# Altium project sx1278.PrjPcb
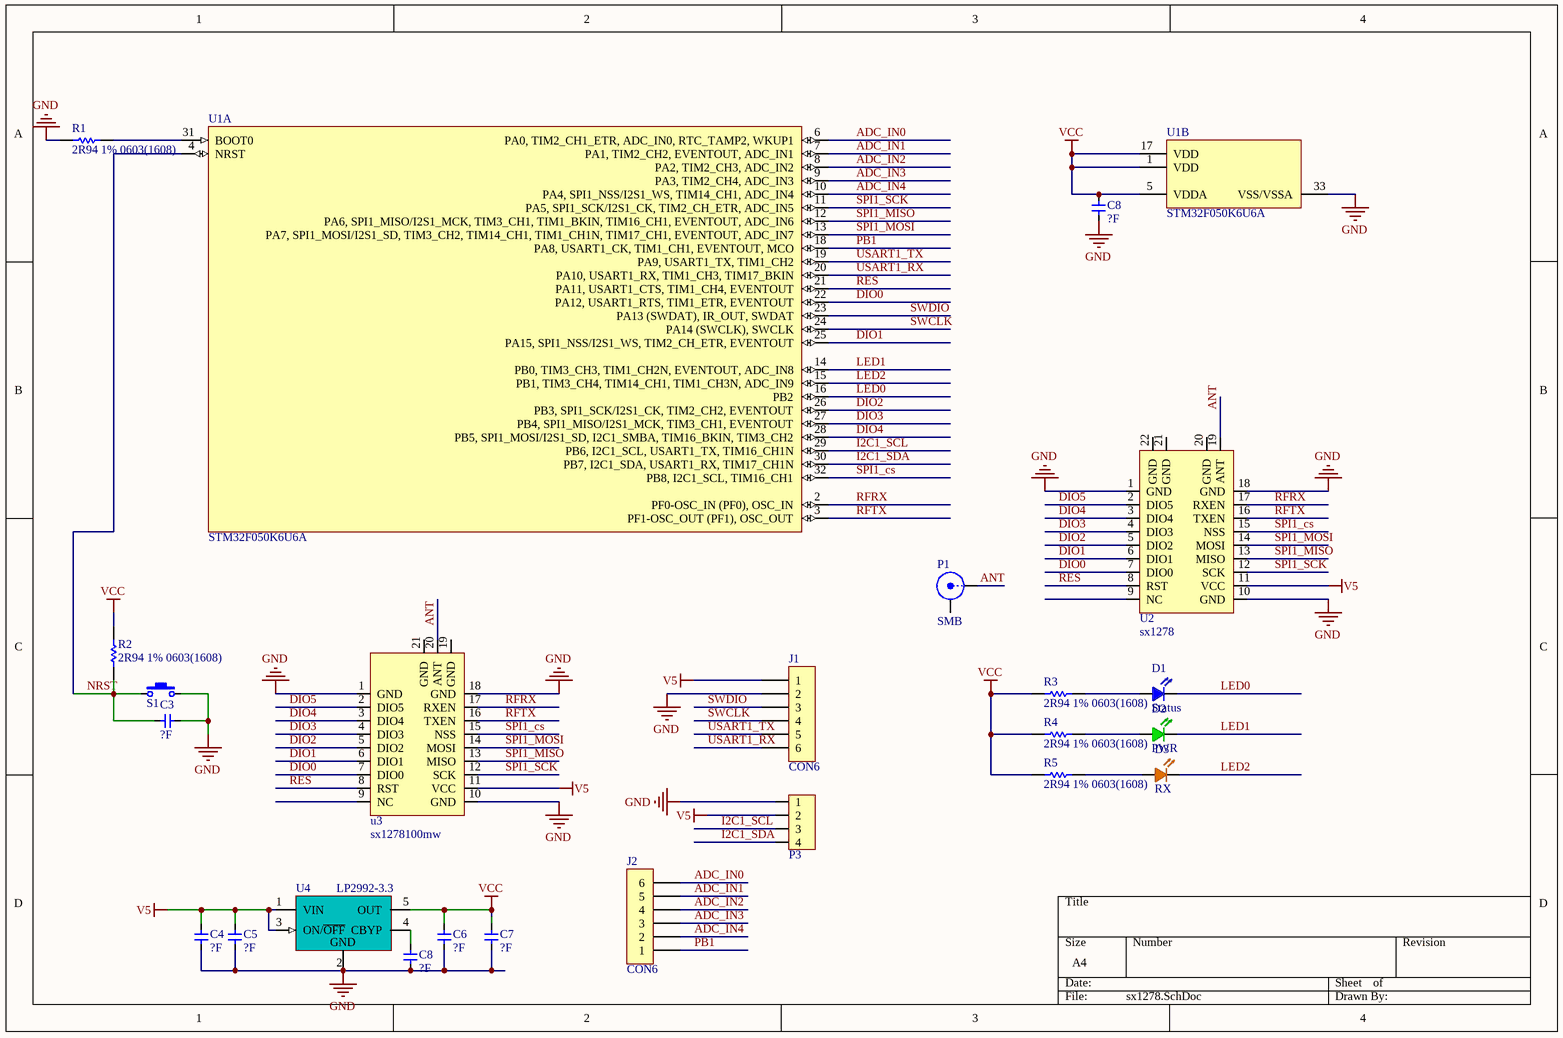
[diagram p0: sx1278.SchDoc]
1 sheet, 24 parts. Net scope: global (net labels, ports and power ports of the same name join across sheets).
Board file: sx1278.PcbDoc

## Sheet sx1278.SchDoc
size A4

### Parts
(Parts that share a designator on the sheet are numbered #1, #2 ... from top to bottom, then left to right.)
C3  value ?F  [0603AC]  (hidden comment: Cap_0603)
C4  value ?F  [C1206]  (hidden comment: Cap_0603)
C5  value ?F  [0603AC]  (hidden comment: Cap_0603)
C6  value ?F  [C1206]  (hidden comment: Cap_0603)
C7  value ?F  [0603AC]  (hidden comment: Cap_0603)
C8#1  value ?F  [0603AC]  (hidden comment: Cap_0603)
C8#2  value ?F  [0603AC]  (hidden comment: Cap_0603)
D1  Status  [LED_0603_BLUE]
D2  PWR  [LED_0603_GREEN]
D3  RX  [LED_0603_YELLOW]
J1  CON6  [DF13C-6P-1.25V]
J2  CON6  [HDR1X6]
P1  SMB  [SMB_V-RJ45]
P3  HDR1x4_1.27  [HDR1X4]  (value not drawn)
R1  2R94 1% 0603(1608)  [RESC0603(1608)_L]
R2  2R94 1% 0603(1608)  [RESC0603(1608)_L]
R3  2R94 1% 0603(1608)  [RESC0603(1608)_L]
R4  2R94 1% 0603(1608)  [RESC0603(1608)_L]
R5  2R94 1% 0603(1608)  [RESC0603(1608)_L]
S1  ButtonTACT_3x6x2.5_180  [按键-贴片]  (value not drawn)
U1  STM32F050K6U6A  [UFQFPN32_M]  (parts A,B of 2)
U2  sx1278  [SPI-E19-433MS1W]
u3  sx1278100mw  [PCBComponent_1 - duplicate]
U4  LP2992-3.3  [SOT23-5L]

### Nets
GND: C3.2 C4.1 C5.1 C6.1 C7.1 C8#1.1 C8#2.1 J1.2 P3.1 R1.1 S1.2 U1.33(VSS/VSSA) U2.1(GND) U2.10(GND) U2.18(GND) u3.1(GND) u3.10(GND) u3.18(GND) U4.2(GND)
V5: C4.2 C5.2 J1.1 P3.2 U2.11(VCC) u3.11(VCC) U4.1(VIN) U4.3(ON/~{OFF})
VCC: C6.2 C7.2 C8#1.2 R2.2 R3.1 R4.1 R5.1 U1.1(VDD) U1.5(VDDA) U1.17(VDD) U4.5(OUT)
ADC_IN0: J2.6 U1.6(PA0,_TIM2_CH1_ETR,_ADC_IN0,_RTC_TAMP2,_WKUP1)
ADC_IN1: J2.5 U1.7(PA1,_TIM2_CH2,_EVENTOUT,_ADC_IN1)
ADC_IN2: J2.4 U1.8(PA2,_TIM2_CH3,_ADC_IN2)
ADC_IN3: J2.3 U1.9(PA3,_TIM2_CH4,_ADC_IN3)
ADC_IN4: J2.2 U1.10(PA4,_SPI1_NSS/I2S1_WS,_TIM14_CH1,_ADC_IN4)
ANT: P1.1(X) U2.19(ANT) u3.20(ANT)
DIO0: U1.22(PA12,_USART1_RTS,_TIM1_ETR,_EVENTOUT) U2.7(DIO0) u3.7(DIO0)
DIO1: U1.25(PA15,_SPI1_NSS/I2S1_WS,_TIM2_CH_ETR,_EVENTOUT) U2.6(DIO1) u3.6(DIO1)
DIO2: U1.26(PB3,_SPI1_SCK/I2S1_CK,_TIM2_CH2,_EVENTOUT) U2.5(DIO2) u3.5(DIO2)
DIO3: U1.27(PB4,_SPI1_MISO/I2S1_MCK,_TIM3_CH1,_EVENTOUT) U2.4(DIO3) u3.4(DIO3)
DIO4: U1.28(PB5,_SPI1_MOSI/I2S1_SD,_I2C1_SMBA,_TIM16_BKIN,_TIM3_CH2) U2.3(DIO4) u3.3(DIO4)
DIO5: U2.2(DIO5) u3.2(DIO5)
I2C1_SCL: P3.3 U1.29(PB6,_I2C1_SCL,_USART1_TX,_TIM16_CH1N)
I2C1_SDA: P3.4 U1.30(PB7,_I2C1_SDA,_USART1_RX,_TIM17_CH1N)
LED0: D1.1(K) U1.16(PB2)
LED1: D2.1(K) U1.14(PB0,_TIM3_CH3,_TIM1_CH2N,_EVENTOUT,_ADC_IN8)
LED2: D3.1(K) U1.15(PB1,_TIM3_CH4,_TIM14_CH1,_TIM1_CH3N,_ADC_IN9)
NRST: C3.1 R2.1 S1.1 U1.4(NRST)
PB1: J2.1 U1.18(PA8,_USART1_CK,_TIM1_CH1,_EVENTOUT,_MCO)
RES: U1.21(PA11,_USART1_CTS,_TIM1_CH4,_EVENTOUT) U2.8(RST) u3.8(RST)
RFRX: U1.2(PF0-OSC_IN_(PF0),_OSC_IN) U2.17(RXEN) u3.17(RXEN)
RFTX: U1.3(PF1-OSC_OUT_(PF1),_OSC_OUT) U2.16(TXEN) u3.16(TXEN)
SPI1_cs: U1.32(PB8,_I2C1_SCL,_TIM16_CH1) U2.15(NSS) u3.15(NSS)
SPI1_MISO: U1.12(PA6,_SPI1_MISO/I2S1_MCK,_TIM3_CH1,_TIM1_BKIN,_TIM16_CH1,_EVENTOUT,_ADC_IN6) U2.13(MISO) u3.13(MISO)
SPI1_MOSI: U1.13(PA7,_SPI1_MOSI/I2S1_SD,_TIM3_CH2,_TIM14_CH1,_TIM1_CH1N,_TIM17_CH1,_EVENTOUT,_ADC_IN7) U2.14(MOSI) u3.14(MOSI)
SPI1_SCK: U1.11(PA5,_SPI1_SCK/I2S1_CK,_TIM2_CH_ETR,_ADC_IN5) U2.12(SCK) u3.12(SCK)
SWCLK: J1.4 U1.24(PA14_(SWCLK),_SWCLK)
SWDIO: J1.3 U1.23(PA13_(SWDAT),_IR_OUT,_SWDAT)
USART1_RX: J1.6 U1.20(PA10,_USART1_RX,_TIM1_CH3,_TIM17_BKIN)
USART1_TX: J1.5 U1.19(PA9,_USART1_TX,_TIM1_CH2)
NetC8#2_2: C8#2.2 U4.4(CBYP)
NetD1_2: D1.2(A) R3.2
NetD2_2: D2.2(A) R4.2
NetD3_2: D3.2(A) R5.2
NetR1_2: R1.2 U1.31(BOOT0)

Not connected (* = marked no-connect by the designer): P1 2(Y); U2 9(NC) 20(GND) 21(GND) 22(GND); u3 9(NC) 19(GND) 21(GND)

### Library data of the parts
C3-C7 C8#1 C8#2 = Cap_0603: Capacitor
D1 = LED 603 Bl: Blue 603 LED; Supplier 1: Digi-Key; Supplier Part Number 1: 350-2037-1-ND
D2 = LED 603 Gr: Green 603 LED; Value: 2.1v 20mA; Supplier 1: Digi-Key; Supplier Part Number 1: 754-1116-1-ND
D3 = LED 603 Or: Orange 603 LED; Value: 2.1v 20mA; Supplier 1: Digi-Key; Supplier Part Number 1: 754-1120-1-ND
J1 J2 = CON6: Connector
P1 = SMB: SMB Straight Connector; LatestRevisionDate: 17-Jul-2002; LatestRevisionNote: Re-released for DXP Platform.; Publisher: Altium Limited
P3 = HDR1x4_1.27: Header
R1-R5 = CMP-1012-00222-1: 2R94 0.1W 1% 0603 (1608 Metric)  SMD; Case-Metric: 1608; Case-EIA: 0603; Value: 2.94 Ohm; Power: 0.1 W; Technology: SMT; Tolerance: 1 %
S1 = ButtonTACT_3x6x2.5_180: Button
U1 = STM32F050K6U6A: ARM Cortex-M0 32-bit RISC core (48 MHz max), 32kB Flash, 4 kB Internal RAM, 27 High Current I/Os, -40 to +85癈, 32-Pin UFQFPN, Tray; 16-bit timers (IC/OC/PWM): 5x16-bit; 32-bit timer (IC/OC/PWM): 1x32-bit; Other timer functions: 2 x WDG, RTC, 24-bit down counter; A/D Converter: 10x12-bit; Serial Interface: 1xSPI;1xI2S;1xI2C;1xUSART(IrDA, ISO 7816); Supply Current(Icc) (Lowest power mode) typ (礎): 1.65; Supply Current(Icc) (Run mode (per Mhz)) typ (礎): 250; DatasheetVersion: rev2, Feb-2012; PackageVersion: 2010; PackageReference: UFQFPN32; PackageDescription: 32-Pin Ultra Thin Fine Pitch Quad Flat No-Lead, 5 x 5 X 0.6 mm Body, 0.5 mm Pitch, Exposed Pad; ComponentLink1Description: Manufacturer URL; ComponentLink1URL: http://www.st.com/; ComponentLink2Description: Datasheet; ComponentLink2URL: http://www.st.com/internet/com/TECHNICAL_RESOURCES/TECHNICAL_LITERATURE/DATA_BRIEF/DM00047078.pdf; ComponentLink3Description: STM32F0 Web Page; ComponentLink3URL: http://www.st.com/internet/mcu/subclass/1588.jsp
U4 = LP2985-3.3: 3.3V 250mA LDO Regulator; Manufacturer: National Semiconductor; Manufacturer Part Number: LP2992AIM5-3.3/NOPB; Regulator Topology: Positive Fixed; Voltage - Input: Up to 16V; Voltage - Dropout (Typical): 0.45V @ 250mA; Number of Regulators: 1; Supplier 1: Digi-Key; Supplier Part Number 1: LP2992AIM5-3.3CT-ND; RoHS: RoHS Compliant; Category: Integrated Circuits (ICs); Stock 1: 15821; Pricing 1: 1=1.86, 25=1.4712, 100=1.3239, 250=1.15224, 500=1.02966 (AUD); Voltage - Output: 3.3V; Current - Output: 250mA; Current - Limit (Min): -; Operating Temperature: -40癈 ~ 125癈; Mounting Type: Surface Mount; Package / Case: SC-74A, SOT-753; Supplier Device Package: SOT-23-5; Packaging: Cut Tape (CT); ComponentLink1URL: http://www.national.com/ds/LP/LP2992.pdf; ComponentLink1Description: http://www.national.com/ds/LP/LP2992.pdf